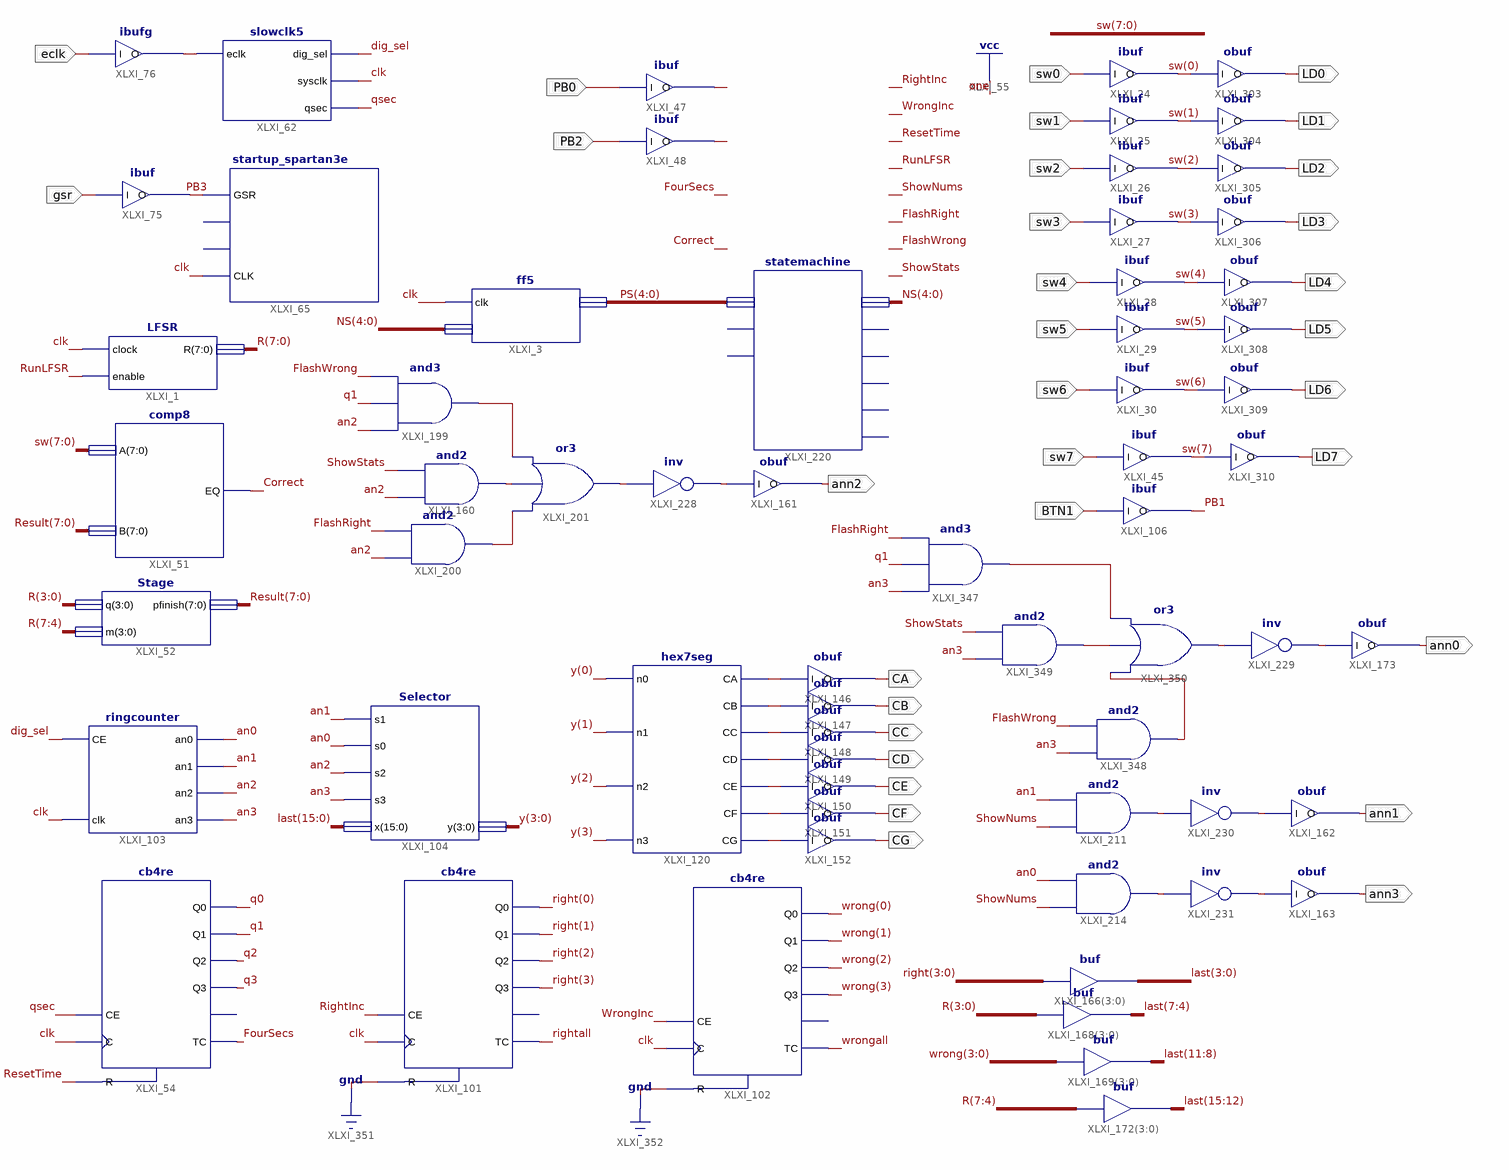
[diagram p0: schematic sheet 1]
// Xilinx ISE schematic Top.sch (spartan3e) as structural Verilog: 63 symbols, 32 ports
module Top (
  input  eclk,
  input  gsr,
  input  PB0,
  input  PB2,
  input  sw0,
  input  sw1,
  input  sw2,
  input  sw3,
  input  sw4,
  input  BTN1,
  input  sw5,
  input  sw6,
  input  sw7,
  output ann2,
  output CA,
  output CB,
  output CC,
  output CD,
  output CE,
  output CF,
  output CG,
  output LD1,
  output LD2,
  output LD3,
  output LD4,
  output LD0,
  output ann3,
  output ann1,
  output LD5,
  output LD6,
  output LD7,
  output ann0
);

  wire an0, an1, an2, an3, clk, Correct, dig_sel, FlashRight, FlashWrong, FourSecs, PB1, PB3, q0, q1, q2, q3,
       qsec, ResetTime, rightall, RightInc, RunLFSR, ShowNums, ShowStats, wrongall, WrongInc, XLXN_65,
       XLXN_66, XLXN_126, XLXN_360, XLXN_361, XLXN_362, XLXN_363, XLXN_364, XLXN_365, XLXN_366, XLXN_398,
       XLXN_442, XLXN_479, XLXN_487, XLXN_488, XLXN_489, XLXN_490, XLXN_492, XLXN_493, XLXN_830, XLXN_834,
       XLXN_864, XLXN_865, XLXN_866;
  wire [3:0] right, wrong, y;
  wire [7:0] R, Result, sw;
  wire [15:0] last;

  slowclk5 XLXI_62 (.eclk(XLXN_126), .dig_sel(dig_sel), .sysclk(clk), .qsec(qsec));
  ibufg #(.LOC("B8")) XLXI_76 (.I(eclk), .O(XLXN_126));
  startup_spartan3e XLXI_65 (.CLK(clk), .GSR(PB3));  // open: GTS, MBT
  ibuf #(.LOC("A7")) XLXI_75 (.I(gsr), .O(PB3));
  ff5 XLXI_3 (.clk(clk));  // open: D, Q
  ibuf #(.LOC("G12")) XLXI_47 (.I(PB0), .O(XLXN_65));
  ibuf #(.LOC("M4")) XLXI_48 (.I(PB2), .O(XLXN_66));
  LFSR XLXI_1 (.clock(clk), .enable(RunLFSR), .R(R));
  comp8 XLXI_51 (.A(sw), .B(Result), .EQ(Correct));
  Stage XLXI_52 (.q(R[3:0]), .m(R[7:4]), .pfinish(Result));
  obuf #(.LOC("M13")) XLXI_161 (.I(XLXN_493), .O(ann2));
  statemachine XLXI_220 ();  // open: PS, NS, pb0, pb2, increment, decrement, showstat, reset, gradestop
  not XLXI_228 (XLXN_493, XLXN_479);
  ringcounter XLXI_103 (.CE(dig_sel), .clk(clk), .an0(an0), .an1(an1), .an2(an2), .an3(an3));
  Selector XLXI_104 (.s1(an1), .s0(an0), .s2(an2), .s3(an3), .x(last), .y(y));
  hex7seg XLXI_120 (
    .n0(y[0]), .n1(y[1]), .n2(y[2]), .n3(y[3]), .CA(XLXN_360), .CB(XLXN_361), .CC(XLXN_362), .CD(XLXN_363),
    .CE(XLXN_364), .CF(XLXN_365), .CG(XLXN_366));
  obuf #(.LOC("L14")) XLXI_146 (.I(XLXN_360), .O(CA));
  obuf #(.LOC("H12")) XLXI_147 (.I(XLXN_361), .O(CB));
  obuf #(.LOC("N14")) XLXI_148 (.I(XLXN_362), .O(CC));
  obuf #(.LOC("N11")) XLXI_149 (.I(XLXN_363), .O(CD));
  obuf #(.LOC("P12")) XLXI_150 (.I(XLXN_364), .O(CE));
  obuf #(.LOC("L13")) XLXI_151 (.I(XLXN_365), .O(CF));
  obuf #(.LOC("M12")) XLXI_152 (.I(XLXN_366), .O(CG));
  ibuf #(.LOC("P11")) XLXI_24 (.I(sw0), .O(sw[0]));
  ibuf #(.LOC("L3")) XLXI_25 (.I(sw1), .O(sw[1]));
  ibuf #(.LOC("K3")) XLXI_26 (.I(sw2), .O(sw[2]));
  ibuf #(.LOC("B4")) XLXI_27 (.I(sw3), .O(sw[3]));
  obuf #(.LOC("M5")) XLXI_303 (.I(sw[0]), .O(LD0));
  obuf #(.LOC("M11")) XLXI_304 (.I(sw[1]), .O(LD1));
  obuf #(.LOC("P7")) XLXI_305 (.I(sw[2]), .O(LD2));
  obuf #(.LOC("P6")) XLXI_306 (.I(sw[3]), .O(LD3));
  obuf #(.LOC("N5")) XLXI_307 (.I(sw[4]), .O(LD4));
  ibuf #(.LOC("G3")) XLXI_28 (.I(sw4), .O(sw[4]));
  cb4re XLXI_54 (.C(clk), .CE(qsec), .R(ResetTime), .Q0(q0), .Q1(q1), .Q2(q2), .Q3(q3), .TC(FourSecs));  // open: CEO
  cb4re XLXI_102 (
    .C(clk), .CE(WrongInc), .R(1'b0), .Q0(wrong[0]), .Q1(wrong[1]), .Q2(wrong[2]), .Q3(wrong[3]),
    .TC(wrongall));  // open: CEO
  assign last[3:0] = right;  // buf XLXI_166[3..0], 4 bits wide
  assign last[7:4] = R[3:0];  // buf XLXI_168[3..0], 4 bits wide
  assign last[11:8] = wrong;  // buf XLXI_169[3..0], 4 bits wide
  assign last[15:12] = R[7:4];  // buf XLXI_172[3..0], 4 bits wide
  and XLXI_211 (XLXN_487, ShowNums, an1);
  and XLXI_214 (XLXN_488, ShowNums, an0);
  obuf #(.LOC("K14")) XLXI_163 (.I(XLXN_489), .O(ann3));
  not XLXI_231 (XLXN_489, XLXN_488);
  obuf #(.LOC("J12")) XLXI_162 (.I(XLXN_490), .O(ann1));
  not XLXI_230 (XLXN_490, XLXN_487);
  ibuf #(.LOC("C11")) XLXI_106 (.I(BTN1), .O(PB1));
  ibuf #(.LOC("F3")) XLXI_29 (.I(sw5), .O(sw[5]));
  ibuf #(.LOC("E2")) XLXI_30 (.I(sw6), .O(sw[6]));
  ibuf #(.LOC("N3")) XLXI_45 (.I(sw7), .O(sw[7]));
  obuf #(.LOC("N4")) XLXI_308 (.I(sw[5]), .O(LD5));
  obuf #(.LOC("P4")) XLXI_309 (.I(sw[6]), .O(LD6));
  obuf #(.LOC("G1")) XLXI_310 (.I(sw[7]), .O(LD7));
  and XLXI_347 (XLXN_864, an3, q1, FlashRight);
  and XLXI_348 (XLXN_866, an3, FlashWrong);
  and XLXI_349 (XLXN_865, an3, ShowStats);
  and XLXI_199 (XLXN_830, an2, q1, FlashWrong);
  and XLXI_160 (XLXN_834, an2, ShowStats);
  and XLXI_200 (XLXN_442, an2, FlashRight);
  or XLXI_201 (XLXN_479, XLXN_442, XLXN_834, XLXN_830);
  not XLXI_229 (XLXN_492, XLXN_398);
  obuf #(.LOC("F12")) XLXI_173 (.I(XLXN_492), .O(ann0));
  or XLXI_350 (XLXN_398, XLXN_866, XLXN_865, XLXN_864);
  cb4re XLXI_101 (
    .C(clk), .CE(RightInc), .R(1'b0), .Q0(right[0]), .Q1(right[1]), .Q2(right[2]), .Q3(right[3]),
    .TC(rightall));  // open: CEO
endmodule
